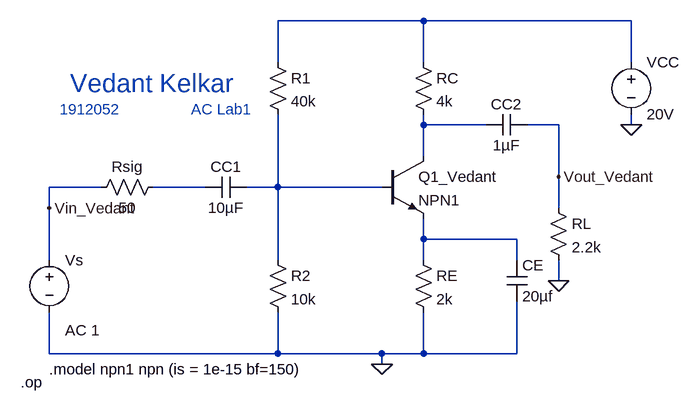
[diagram p0: schematic AC2_lab1.asc]
AC2_lab1.asc, the LTspice schematic file:
Version 4
SHEET 1 1856 1016
WIRE 368 0 144 0
WIRE 688 0 368 0
WIRE 144 64 144 0
WIRE 368 64 368 0
WIRE 688 64 688 0
WIRE 368 160 368 144
WIRE 464 160 368 160
WIRE 576 160 528 160
WIRE 688 160 688 144
WIRE 368 208 368 160
WIRE 576 240 576 160
WIRE -128 256 -208 256
WIRE 32 256 -48 256
WIRE 144 256 144 144
WIRE 144 256 96 256
WIRE 304 256 144 256
WIRE -208 288 -208 256
WIRE 576 288 576 240
WIRE 368 336 368 304
WIRE 512 336 368 336
WIRE -208 368 -208 288
WIRE 144 368 144 256
WIRE 368 368 368 336
WIRE 512 368 512 336
WIRE 576 400 576 368
WIRE -208 512 -208 448
WIRE 144 512 144 448
WIRE 144 512 -208 512
WIRE 304 512 144 512
WIRE 368 512 368 448
WIRE 368 512 304 512
WIRE 512 512 512 432
WIRE 512 512 368 512
WIRE 304 528 304 512
FLAG 576 400 0
FLAG 688 160 0
FLAG 304 528 0
FLAG -208 288 Vin_Vedant
FLAG 576 240 Vout_Vedant
SYMBOL res 128 48 R0
SYMATTR InstName R1
SYMATTR Value 40k
SYMBOL res 352 48 R0
SYMATTR InstName RC
SYMATTR Value 4k
SYMBOL res 352 352 R0
SYMATTR InstName RE
SYMATTR Value 2k
SYMBOL res 128 352 R0
SYMATTR InstName R2
SYMATTR Value 10k
SYMBOL npn 304 208 R0
SYMATTR InstName Q1_Vedant
SYMATTR Value NPN1
SYMBOL res -32 240 R90
WINDOW 0 0 56 VBottom 2
WINDOW 3 32 56 VTop 2
SYMATTR InstName Rsig
SYMATTR Value 50
SYMBOL cap 96 240 R90
WINDOW 0 0 32 VBottom 2
WINDOW 3 32 32 VTop 2
SYMATTR InstName CC1
SYMATTR Value 10µF
SYMBOL voltage -208 352 R0
WINDOW 123 24 124 Left 2
WINDOW 39 0 0 Left 0
SYMATTR Value2 AC 1
SYMATTR InstName Vs
SYMATTR Value ""
SYMBOL res 560 272 R0
SYMATTR InstName RL
SYMATTR Value 2.2k
SYMBOL cap 496 368 R0
SYMATTR InstName CE
SYMATTR Value 20µf
SYMBOL voltage 688 48 R0
SYMATTR InstName VCC
SYMATTR Value 20V
SYMBOL cap 528 144 R90
WINDOW 0 0 32 VBottom 2
WINDOW 3 32 32 VTop 2
SYMATTR InstName CC2
SYMATTR Value 1µF
TEXT -176 96 Left 4 ;Vedant Kelkar
TEXT -192 136 Left 2 ;1912052                AC Lab1
TEXT -208 536 Left 2 !.model npn1 npn (is = 1e-15 bf=150)
TEXT -252 556 Left 2 !.op

The netlist it stands for:
* AC2_lab1.asc
R1 N001 N004 40k
RC N001 N002 4k
RE N005 0 2k
R2 N004 0 10k
Q1_Vedant N002 N004 N005 0 NPN1
Rsig N003 Vin_Vedant 50
CC1 N004 N003 10µF
Vs Vin_Vedant 0 AC 1
RL Vout_Vedant 0 2.2k
CE N005 0 20µf
VCC N001 0 20V
CC2 Vout_Vedant N002 1µF
.model NPN NPN
.model PNP PNP
.lib standard.bjt
* Vedant Kelkar
* 1912052                AC Lab1
.model npn1 npn (is = 1e-15 bf=150)
.op
.backanno
.end